# Altium project Opticni HRM.PrjPcb
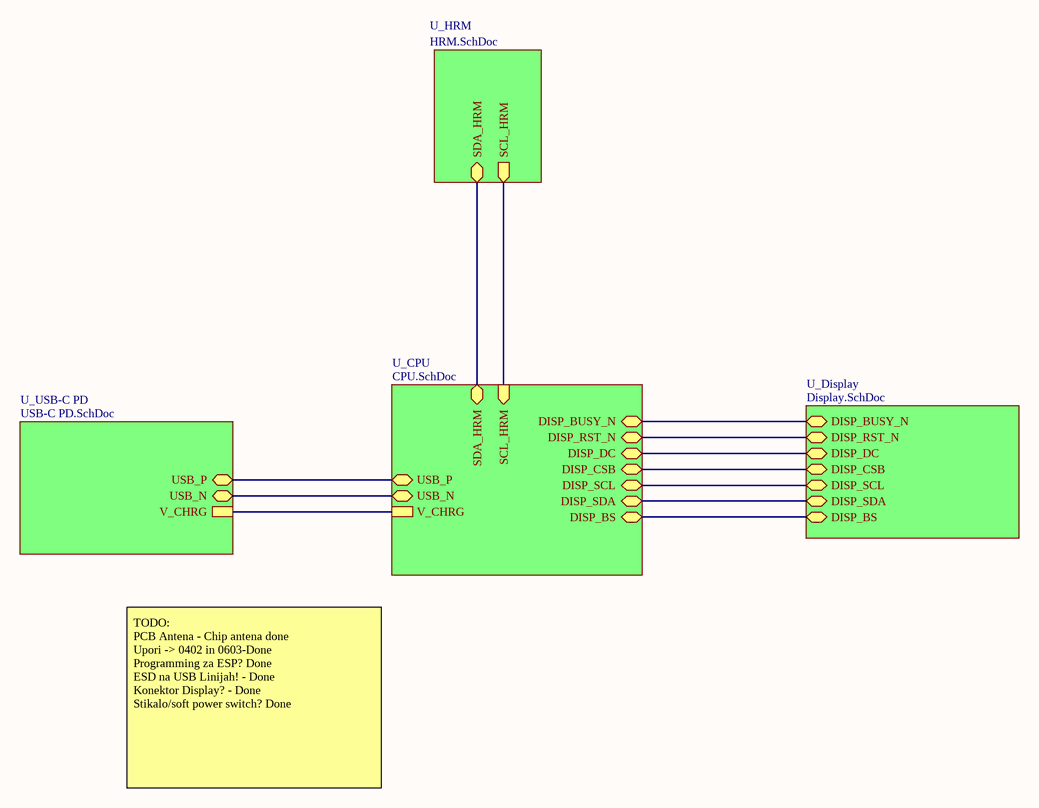
[diagram p0: Main.SchDoc]
5 sheets, 75 parts. Net scope: hierarchical (ports join the sheet entries above them; power ports are global).
Board file: HRM_0.1.PcbDoc
Sheets:
  Main.SchDoc
    U_HRM = HRM.SchDoc
    U_CPU = CPU.SchDoc
    U_Display = Display.SchDoc
    U_USB-C PD = USB-C PD.SchDoc

## Sheet Main.SchDoc
size A4

### Sub-sheets
U_CPU = CPU.SchDoc: SDA_HRM (bidir), SCL_HRM (in), DISP_BUSY_N (bidir), DISP_RST_N (bidir), DISP_DC (bidir), DISP_CSB (bidir), DISP_SCL (bidir), DISP_SDA (bidir), DISP_BS (bidir), USB_P (bidir), USB_N (bidir), V_CHRG
U_Display = Display.SchDoc: DISP_BUSY_N (bidir), DISP_RST_N (bidir), DISP_DC (bidir), DISP_CSB (bidir), DISP_SCL (bidir), DISP_SDA (bidir), DISP_BS (bidir)
U_HRM = HRM.SchDoc: SDA_HRM (bidir), SCL_HRM (out)
U_USB-C PD = USB-C PD.SchDoc: USB_P (bidir), USB_N (bidir), V_CHRG

### Nets
SCL_HRM: sheet U_HRM/SCL_HRM, sheet U_CPU/SCL_HRM
SDA_HRM: sheet U_HRM/SDA_HRM, sheet U_CPU/SDA_HRM
USB_N: sheet U_CPU/USB_N, sheet U_USB-C PD/USB_N
USB_P: sheet U_CPU/USB_P, sheet U_USB-C PD/USB_P
NetDS1_8: sheet U_CPU/DISP_BS, sheet U_Display/DISP_BS
NetDS1_9: sheet U_CPU/DISP_BUSY_N, sheet U_Display/DISP_BUSY_N
NetDS1_10: sheet U_CPU/DISP_RST_N, sheet U_Display/DISP_RST_N
NetDS1_11: sheet U_CPU/DISP_DC, sheet U_Display/DISP_DC
NetDS1_12: sheet U_CPU/DISP_CSB, sheet U_Display/DISP_CSB
NetDS1_13: sheet U_CPU/DISP_SCL, sheet U_Display/DISP_SCL
NetDS1_14: sheet U_CPU/DISP_SDA, sheet U_Display/DISP_SDA
NetR4_2: sheet U_CPU/V_CHRG, sheet U_USB-C PD/V_CHRG

### Notes on the sheet
- TODO:
  PCB Antena - Chip antena done
  Upori -> 0402 in 0603-Done
  Programming za ESP? Done
  ESD na USB Linijah! - Done
  Konektor Display? - Done
  Stikalo/soft power switch? Done

## Sheet HRM.SchDoc
size A4
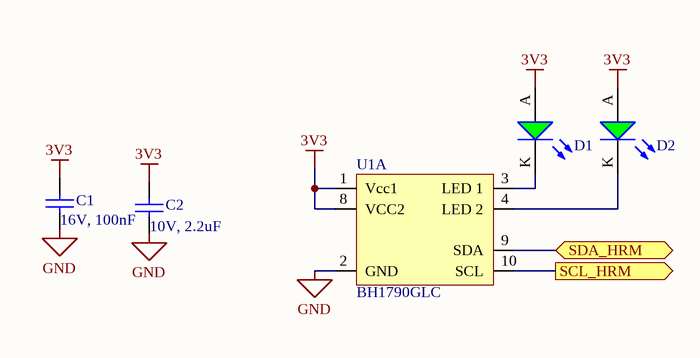
[diagram p1: HRM.SchDoc]

### Parts
C1  16V, 100nF  [0603_1.6x0.8x0.8mm_Reflow Soldering]
C2  10V, 2.2uF  [0603_1.6x0.8x0.8mm_Reflow Soldering]
D1  Bright Green, 2V, 140°  [WL-SMCW_0603_150060xx75003]  (value not drawn)
D2  Bright Green, 2V, 140°  [WL-SMCW_0603_150060xx75003]  (value not drawn)
U1  BH1790GLC  [WLGA010V28_ROHM]  (part A of 2)

### Ports
SCL_HRM (out), SDA_HRM (bidir)

### Nets
3V3: C1.2 C2.2 D1.A D2.A U1.1(Vcc1) U1.8(VCC2)
GND: C1.1 C2.1 U1.2(GND)
SCL_HRM: U1.10(SCL) ; port SCL_HRM
SDA_HRM: U1.9(SDA) ; port SDA_HRM
NetD1_K: D1.K U1.3(LED_1)
NetD2_K: D2.K U1.4(LED_2)

### Library data of the parts
C1 = 885012206046: WCAP-CSGP Ceramic Capacitors, 0603, X7R, 16V, 100nF; Rated Voltage: 16V DC; ComponentLink1Description: Manufacturer; ComponentLink1URL: http://www.we-online.de; ComponentLink2Description: Datasheet; ComponentLink2URL: http://katalog.we-online.de/pbs/datasheet/885012206046.pdf; Part Number: 885012206046; Published Date: Oct. 2017; Publisher: Wurth Elektronik; Size: 0603; Operating Temperature: -55 °C to +125 °C; Value: 100nF; Ceramic Type: X7R
C2 = 885012206027: WCAP-CSGP Ceramic Capacitors, 0603, X7R, 10V, 2.2uF; Rated Voltage: 10V DC; ComponentLink1Description: Manufacturer; ComponentLink1URL: http://www.we-online.de; ComponentLink2Description: Datasheet; ComponentLink2URL: http://katalog.we-online.de/pbs/datasheet/885012206027.pdf; Part Number: 885012206027; Published Date: Oct. 2017; Publisher: Wurth Elektronik; Size: 0603; Operating Temperature: -55 °C to +125 °C; Value: 2.2uF; Ceramic Type: X7R
D1 D2 = 150060VS75003: WL-SMCW Mono-color Chip LED Waterclear, SMT, size 0603, Bright Green, 2V, 140°; Manufacturer: Wurth Elektronik; Case/Size Code: 0603; Chip Technology: AlInGaP; Dominant Wavelength: 570nm; Luminous Intensity: 100mcd; Peak Wavelength: 572nm; Manufacturer Part Number: 150060VS75003; Category: Signal LEDs; Match Code: WL-SMCW; ComponentLink1Description: Website Link; ComponentLink1URL: https://www.we-online.com/redexpert/article/150060VS75003?ad; ComponentLink2Description: Datasheet Link; ComponentLink2URL: https://www.we-online.com/redexpert/spec/150060VS75003?ad; Mount: Surface Mount; Operating Temperature Max: 100°C; Operating Temperature Min: -40°C; Packaging: Tape and Reel; Length: 1.6mm; Width: 0.8mm; Height: 0.7mm; Emitting Color: Bright Green; Forward Voltage: 2V; Viewing Angle: 140°
U1 = BH1790GLC: Optical Sensor for Heart Rate Monitor IC

## Sheet CPU.SchDoc
size A4
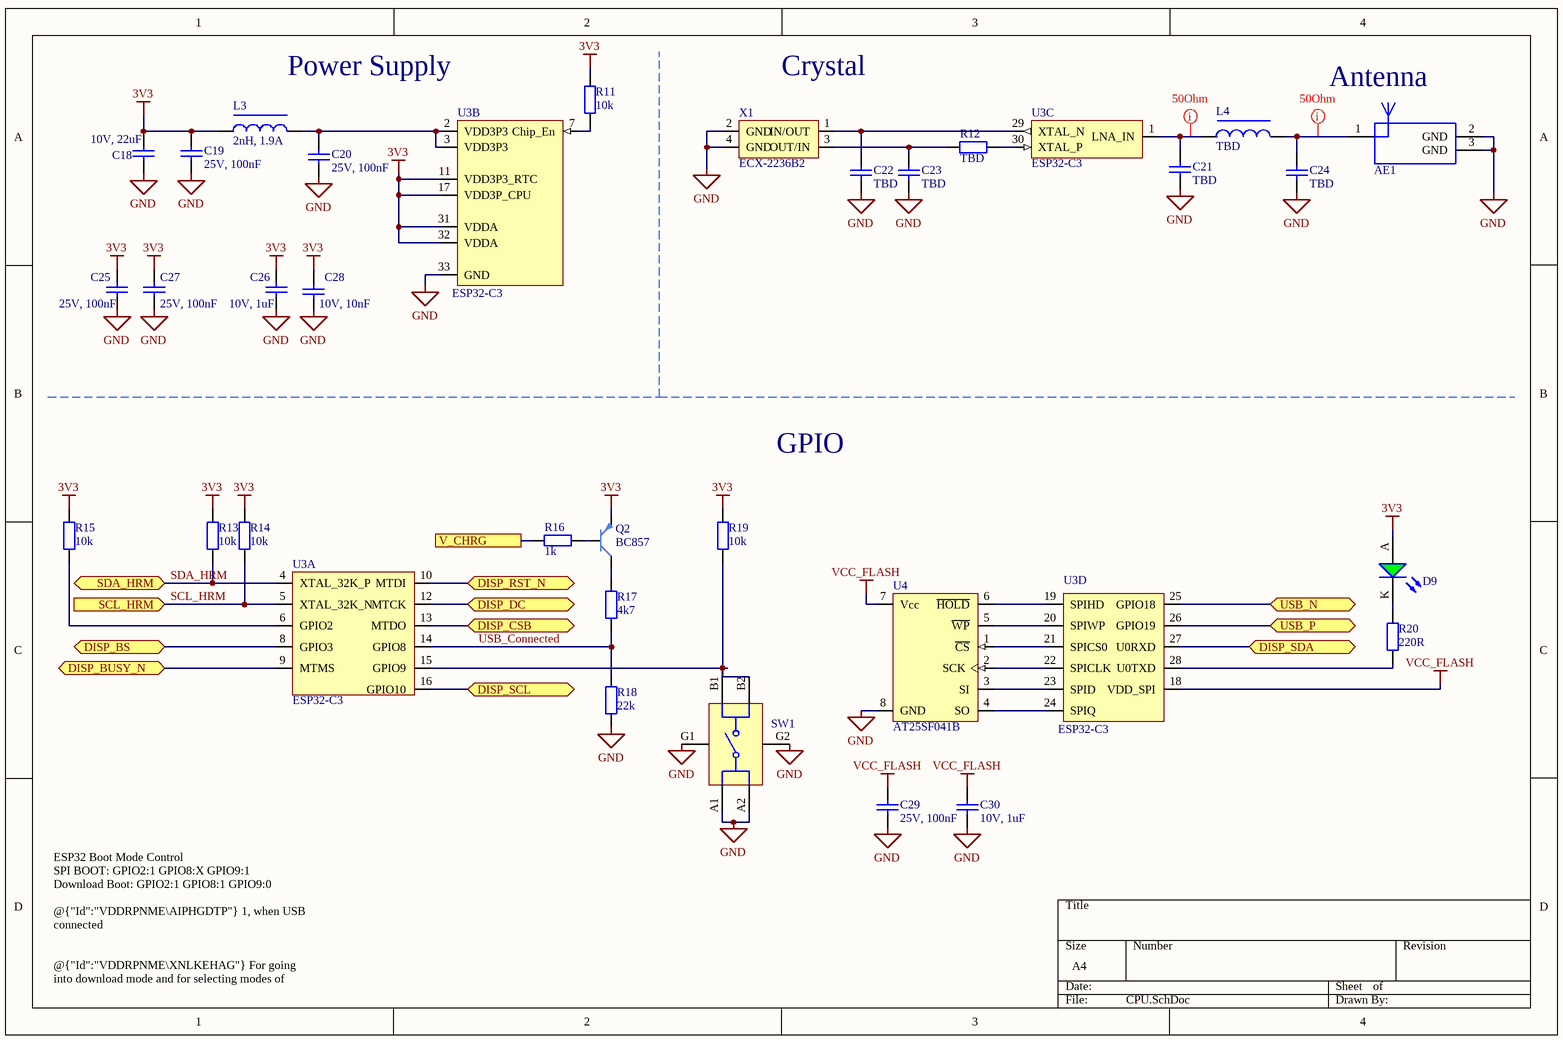
[diagram p2: CPU.SchDoc]

### Parts
AE1  7488960245  [7488960245]  (value not drawn)
C18  10V, 22uF  [0805_2x1.25x1.25mm_Reflow Soldering]
C19  25V, 100nF  [0402_1x0.5x0.5mm]
C20  25V, 100nF  [0402_1x0.5x0.5mm]
C21  TBD  [0402_1x0.5x0.5mm]
C22  TBD  [0402_1x0.5x0.5mm]
C23  TBD  [0402_1x0.5x0.5mm]
C24  TBD  [0402_1x0.5x0.5mm]
C25  25V, 100nF  [0402_1x0.5x0.5mm]
C26  10V, 1uF  [0402_1x0.5x0.5mm]
C27  25V, 100nF  [0402_1x0.5x0.5mm]
C28  10V, 10nF  [0402_1x0.5x0.5mm]
C29  25V, 100nF  [0402_1x0.5x0.5mm]
C30  10V, 1uF  [0402_1x0.5x0.5mm]
D9  Green, 3.2V, 140°  [WL-SMCW_0603_150060xx75003]  (value not drawn)
L3  2nH, 1.9A  [0603CT SERIES]
L4  TBD  [0402CS SERIES]
Q2  BC857  [SOT23]
R11  10k  [R0402]
R12  TBD  [R0402]
R13  10k  [R0402]
R14  10k  [R0402]
R15  10k  [R0402]
R16  1k  [R0402]
R17  4k7  [R0402]
R18  22k  [R0402]
R19  10k  [R0402]
R20  220R  [R0402]
SW1  435151014845  [WS-TASV_L3W2.6H1.4_4351x10148xx]  (value not drawn)
U3  ESP32-C3  [32L SLP Expressif]  (parts A,B,C,D of 4)
U4  AT25SF041B  [SOIC8 Wide dialog semi]
X1  ECX-2236B2  [2.5 x 2.0 mm XTAL]

### Ports
DISP_BS (bidir), DISP_BUSY_N (bidir), DISP_CSB (bidir), DISP_DC (bidir), DISP_RST_N (bidir), DISP_SCL (bidir), DISP_SDA (bidir), SCL_HRM (in), SDA_HRM (bidir), USB_N (bidir), USB_P (bidir), V_CHRG

### Nets
3V3: C18.1 C19.2 C25.2 C26.2 C27.2 C28.2 D9.A L3.1 Q2.2(E) R11.2 R13.2 R14.2 R15.2 R19.2 U3.11(VDD3P3_RTC) U3.17(VDD3P_CPU) U3.31(VDDA) U3.32(VDDA)
GND: AE1.2(GND) AE1.3(GND) C18.2 C19.1 C20.1 C21.1 C22.1 C23.1 C24.1 C25.1 C26.1 C27.1 C28.1 C29.1 C30.1 R18.1 SW1.A1 SW1.A2 SW1.G1(GND) SW1.G2(GND) U3.33(GND) U4.8(GND) X1.2(GND) X1.4(GND)
VCC_FLASH: C29.2 C30.2 U3.18(VDD_SPI) U4.7(Vcc)
SCL_HRM: R14.1 U3.5(XTAL_32K_N) ; port SCL_HRM
SDA_HRM: R13.1 U3.4(XTAL_32K_P) ; port SDA_HRM
USB_Connected: R17.1 R18.2 U3.14(GPIO8)
USB_N: U3.25(GPIO18) ; port USB_N
USB_P: U3.26(GPIO19) ; port USB_P
NetAE1_1: AE1.1(Feed) C24.2 L4.2
NetC20_2: C20.2 L3.2 U3.2(VDD3P3) U3.3(VDD3P3)
NetC21_2: C21.2 L4.1 U3.1(LNA_IN)
NetC22_2: C22.2 U3.29(XTAL_N) X1.1(IN/OUT)
NetC23_2: C23.2 R12.2 X1.3(OUT/IN)
NetD9_K: D9.K R20.2
NetDS1_8: U3.8(GPIO3) ; port DISP_BS
NetDS1_9: U3.9(MTMS) ; port DISP_BUSY_N
NetDS1_10: U3.10(MTDI) ; port DISP_RST_N
NetDS1_11: U3.12(MTCK) ; port DISP_DC
NetDS1_12: U3.13(MTDO) ; port DISP_CSB
NetDS1_13: U3.16(GPIO10) ; port DISP_SCL
NetDS1_14: U3.27(U0RXD) ; port DISP_SDA
NetQ2_1: Q2.1(B) R16.1
NetQ2_3: Q2.3(C) R17.2
NetR4_2: R16.2 ; port V_CHRG
NetR11_1: R11.1 U3.7(Chip_En)
NetR12_1: R12.1 U3.30(XTAL_P)
NetR15_1: R15.1 U3.6(GPIO2)
NetR19_1: R19.1 SW1.B2
NetR20_1: R20.1 U3.28(U0TXD)
NetSW1_B1: SW1.B1 U3.15(GPIO9)
NetU3_19: U3.19(SPIHD) U4.6(~{HOLD})
NetU3_20: U3.20(SPIWP) U4.5(~{WP})
NetU3_21: U3.21(SPICS0) U4.1(~{CS})
NetU3_22: U3.22(SPICLK) U4.2(SCK)
NetU3_23: U3.23(SPID) U4.3(SI)
NetU3_24: U3.24(SPIQ) U4.4(SO)

### Layout directives
mark named 50Ohm: NetAE1_1, NetC21_2

### Notes on the sheet
- Power Supply
- (near X1) Crystal
- (near AE1) Antenna
- GPIO
- ESP32 Boot Mode Control
  SPI BOOT: GPIO2:1 GPIO8:X GPIO9:1
  Download Boot: GPIO2:1 GPIO8:1 GPIO9:0
  @{"Id":"VDDRPNME\AIPHGDTP"} 1, when USB connected
  @{"Id":"VDDRPNME\XNLKEHAG"} For going into download mode and for selecting modes of operation

### Library data of the parts
AE1 = 7488960245: WE-MCA SMT Multilayer Chip Antenna, 1 Band, 2400-2500MHz, 50Ω; Manufacturer: Wurth Elektronik; Number of Bands: 1; Peak Gain: 3dBi; VSWR: 2.5; ComponentLink1Description: Website Link; ComponentLink1URL: https://www.we-online.com/redexpert/article/7488960245?ad; ComponentLink2Description: Datasheet Link; ComponentLink2URL: https://www.we-online.com/redexpert/spec/7488960245?ad; Manufacturer Part Number: 7488960245; Category: Antennas; Match Code: WE-MCA; Mount: Surface Mount; Operating Temperature Max: 85°C; Operating Temperature Min: -40°C; Packaging: Tape and Reel; Length: 5.2mm; Width: 3.7mm; Height: 0.7mm; Frequency Range: 2400-2500MHz; Impedance: 50Ω
C18 = 885012107011: WCAP-CSGP Ceramic Capacitors, 0805, X5R, 10V, 22uF; Rated Voltage: 10V DC; ComponentLink1Description: Manufacturer; ComponentLink1URL: http://www.we-online.de; ComponentLink2Description: Datasheet; ComponentLink2URL: http://katalog.we-online.de/pbs/datasheet/885012107011.pdf; Part Number: 885012107011; Published Date: Oct. 2017; Publisher: Wurth Elektronik; Size: 0805; Operating Temperature: -55 °C to +125 °C; Value: 22uF; Ceramic Type: X5R
C19 C20 C25 C27 C29 = 885012105018: WCAP-CSGP Ceramic Capacitors, 0402, X5R, 25V, 100nF; Rated Voltage: 25V DC; ComponentLink1Description: Manufacturer; ComponentLink1URL: http://www.we-online.de; ComponentLink2Description: Datasheet; ComponentLink2URL: http://katalog.we-online.de/pbs/datasheet/885012105018.pdf; Part Number: 885012105018; Published Date: Oct. 2017; Publisher: Wurth Elektronik; Size: 0402; Operating Temperature: -55 °C to +125 °C; Value: 100nF; Ceramic Type: X5R
C21-C24 = 885012005021: WCAP-CSGP Ceramic Capacitors, 0402, NP0, 16V, 2.2pF; Rated Voltage: 16V DC; ComponentLink1Description: Manufacturer; ComponentLink1URL: http://www.we-online.de; ComponentLink2Description: Datasheet; ComponentLink2URL: http://katalog.we-online.de/pbs/datasheet/885012005021.pdf; Part Number: 885012005021; Published Date: Oct. 2017; Publisher: Wurth Elektronik; Size: 0402; Operating Temperature: -55 °C to +125 °C; Value: 2.2pF; Ceramic Type: NP0
C26 C30 = 885012105012: WCAP-CSGP Ceramic Capacitors, 0402, X5R, 10V, 1uF; Rated Voltage: 10V DC; ComponentLink1Description: Manufacturer; ComponentLink1URL: http://www.we-online.de; ComponentLink2Description: Datasheet; ComponentLink2URL: http://katalog.we-online.de/pbs/datasheet/885012105012.pdf; Part Number: 885012105012; Published Date: Oct. 2017; Publisher: Wurth Elektronik; Size: 0402; Operating Temperature: -55 °C to +125 °C; Value: 1uF; Ceramic Type: X5R
C28 = 885012205012: WCAP-CSGP Ceramic Capacitors, 0402, X7R, 10V, 10nF; Rated Voltage: 10V DC; ComponentLink1Description: Manufacturer; ComponentLink1URL: http://www.we-online.de; ComponentLink2Description: Datasheet; ComponentLink2URL: http://katalog.we-online.de/pbs/datasheet/885012205012.pdf; Part Number: 885012205012; Published Date: Oct. 2017; Publisher: Wurth Elektronik; Size: 0402; Operating Temperature: -55 °C to +125 °C; Value: 10nF; Ceramic Type: X7R
D9 = 150060GS75003: WL-SMCW Mono-color Chip LED Waterclear, SMT, size 0603, Green, 3.2V, 140°; Manufacturer: Wurth Elektronik; Case/Size Code: 0603; Chip Technology: InGaN; Dominant Wavelength: 525nm; Luminous Intensity: 1600mcd; Peak Wavelength: 515nm; Manufacturer Part Number: 150060GS75003; Category: Signal LEDs; Match Code: WL-SMCW; ComponentLink1Description: Website Link; ComponentLink1URL: https://www.we-online.com/redexpert/article/150060GS75003?ad; ComponentLink2Description: Datasheet Link; ComponentLink2URL: https://www.we-online.com/redexpert/spec/150060GS75003?ad; Mount: Surface Mount; Operating Temperature Max: 100°C; Operating Temperature Min: -40°C; Packaging: Tape and Reel; Length: 1.6mm; Width: 0.8mm; Height: 0.7mm; Emitting Color: Green; Forward Voltage: 3.2V; Viewing Angle: 140°
L3 = 0603CT-2N0XJRW
L4 = 0402CT: 0402 Coil - Coilcraft
R11-R20 = Res 0402
SW1 = 435151014845: WS-TASV SMT Tact Switch with ground terminal, SPST-NO, 12VDC, 50mA, 450g; Manufacturer: Wurth Elektronik; Washable: No; ComponentLink1Description: Website Link; ComponentLink1URL: https://www.we-online.com/redexpert/article/435151014845?ad; ComponentLink2Description: Datasheet Link; ComponentLink2URL: https://www.we-online.com/redexpert/spec/435151014845?ad; Manufacturer Part Number: 435151014845; Category: Tact Switches; Match Code: WS-TASV; Mount: Surface Mount; Operating Temperature Max: 85°C; Operating Temperature Min: -40°C; Packaging: Tape and Reel; Length: 3mm; Width: 2.6mm; Height: 1.4mm; Circuit: SPST-NO; Contact Material: Stainless Steel; Contact Plating: Silver; Operation Force: 450g; Rated Current: 50mA; Rated Voltage: 12VDC; Terminal Material: Copper Alloy; Terminal Plating: Silver
U3 = ESP32-C3: Ultra­Low­Power SoC with RISC­V Single­Core CPU / Supporting IEEE 802.11b/g/n (2.4 GHz Wi­Fi) and Bluetooth® 5 (LE)
U4 = AT25SF041B: 4-Mbit SPI Serial Flash Memory with Dual-I/O and Quad-I/O Support
X1 = ECX-2236B2: ECX-2236B2 SMD CRYSTAL 40MHz +-10ppm

## Sheet Display.SchDoc
size A4
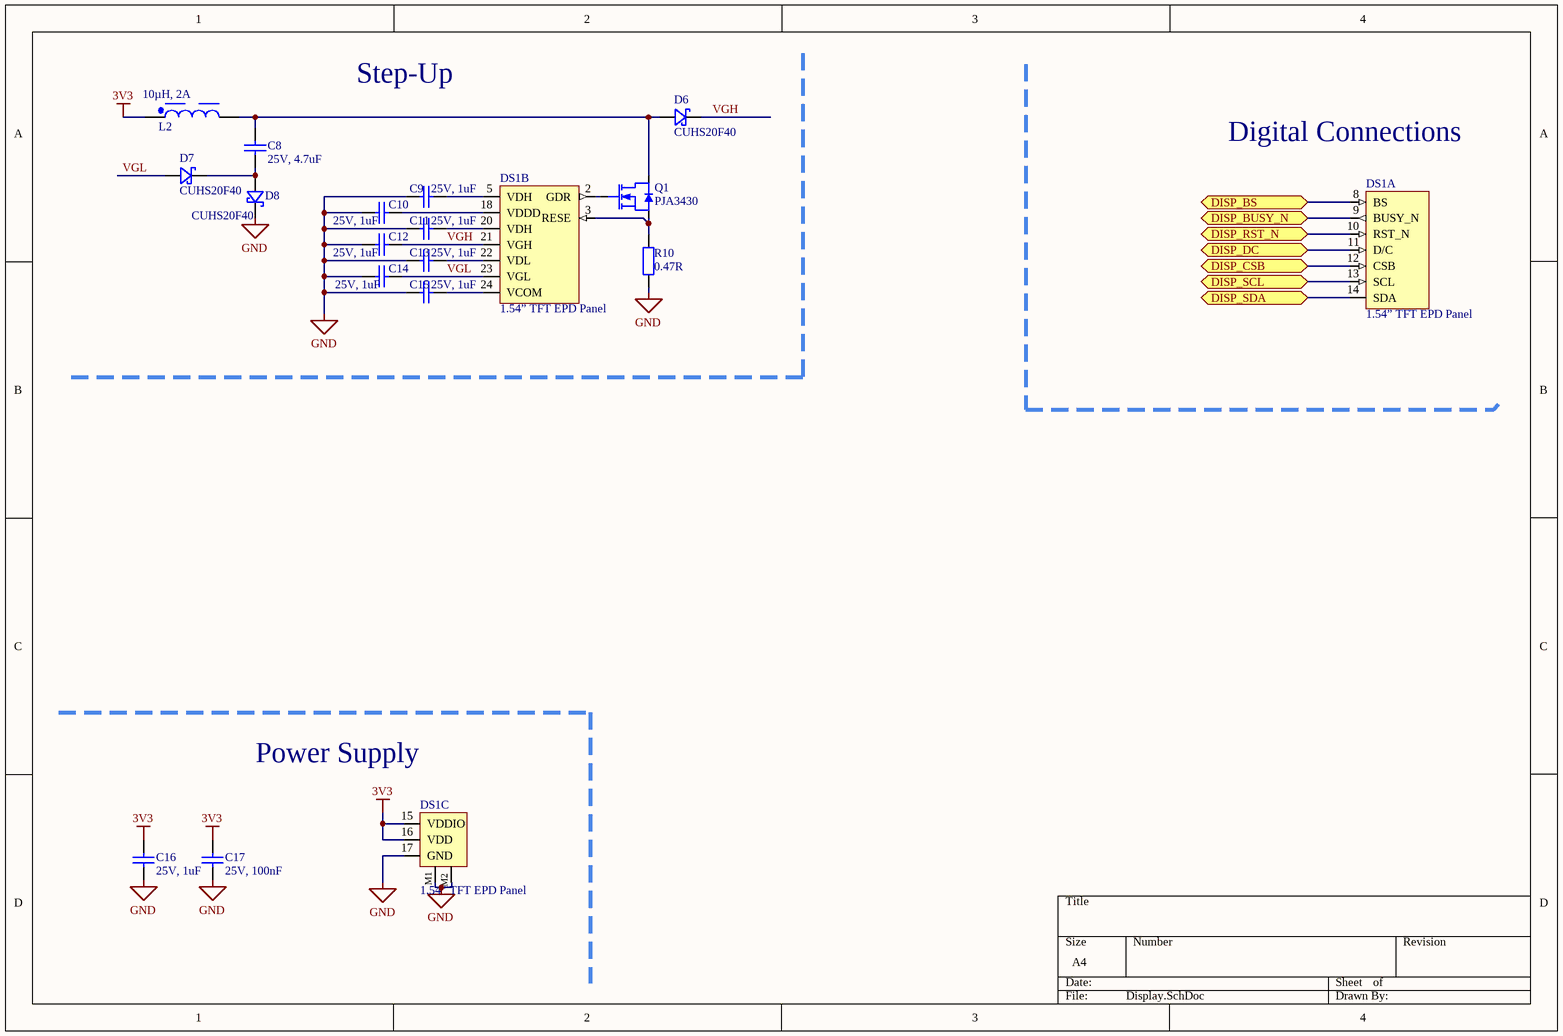
[diagram p3: Display.SchDoc]

### Parts
C8  25V, 4.7uF  [0805_2x1.25x1.25mm_Reflow Soldering]
C9  25V, 1uF  [0603_1.6x0.8x0.8mm_Reflow Soldering]
C10  25V, 1uF  [0603_1.6x0.8x0.8mm_Reflow Soldering]
C11  25V, 1uF  [0603_1.6x0.8x0.8mm_Reflow Soldering]
C12  25V, 1uF  [0603_1.6x0.8x0.8mm_Reflow Soldering]
C13  25V, 1uF  [0603_1.6x0.8x0.8mm_Reflow Soldering]
C14  25V, 1uF  [0603_1.6x0.8x0.8mm_Reflow Soldering]
C15  25V, 1uF  [0603_1.6x0.8x0.8mm_Reflow Soldering]
C16  25V, 1uF  [0603_1.6x0.8x0.8mm_Reflow Soldering]
C17  25V, 100nF  [0402_1x0.5x0.5mm]
D6  CUHS20F40  [Topshiba US2H]
D7  CUHS20F40  [Topshiba US2H]
D8  CUHS20F40  [Topshiba US2H]
DS1  1.54” TFT EPD Panel  [687324124422]  (parts A,B,C of 4)
L2  10µH, 2A  [WE-TPC_8020]
Q1  PJA3430  [SOT23]
R10  value 0.47R  [RES0805_1]  (hidden comment: Res2-smd)

### Ports
DISP_BS (bidir), DISP_BUSY_N (bidir), DISP_CSB (bidir), DISP_DC (bidir), DISP_RST_N (bidir), DISP_SCL (bidir), DISP_SDA (bidir)

### Nets
3V3: C16.2 C17.2 DS1.15(VDDIO) DS1.16(VDD) L2.1
GND: C9.1 C10.1 C11.1 C12.1 C13.1 C14.1 C15.1 C16.1 C17.1 D8.1(K) DS1.17(GND) DS1.M1 DS1.M2 R10.1
VGH: C12.2 D6.1(K) DS1.21(VGH)
VGL: C14.2 D7.2(A) DS1.23(VGL)
NetC8_1: C8.1 D7.1(K) D8.2(A)
NetC8_2: C8.2 D6.2(A) L2.2 Q1.3(D)
NetC9_2: C9.2 DS1.5(VDH)
NetC10_2: C10.2 DS1.18(VDDD)
NetC11_2: C11.2 DS1.20(VDH)
NetC13_2: C13.2 DS1.22(VDL)
NetC15_2: C15.2 DS1.24(VCOM)
NetDS1_2: DS1.2(GDR) Q1.1(G)
NetDS1_3: DS1.3(RESE) Q1.2(S) R10.2
NetDS1_8: DS1.8(BS) ; port DISP_BS
NetDS1_9: DS1.9(BUSY_N) ; port DISP_BUSY_N
NetDS1_10: DS1.10(RST_N) ; port DISP_RST_N
NetDS1_11: DS1.11(D/C) ; port DISP_DC
NetDS1_12: DS1.12(CSB) ; port DISP_CSB
NetDS1_13: DS1.13(SCL) ; port DISP_SCL
NetDS1_14: DS1.14(SDA) ; port DISP_SDA

### Notes on the sheet
- Step-Up
- (near DS1) Digital Connections
- (near DS1) Power Supply

### Library data of the parts
C8 = 885012107018: WCAP-CSGP Ceramic Capacitors, 0805, X5R, 25V, 4.7uF; Rated Voltage: 25V DC; ComponentLink1Description: Manufacturer; ComponentLink1URL: http://www.we-online.de; ComponentLink2Description: Datasheet; ComponentLink2URL: http://katalog.we-online.de/pbs/datasheet/885012107018.pdf; Part Number: 885012107018; Published Date: Oct. 2017; Publisher: Wurth Elektronik; Size: 0805; Operating Temperature: -55 °C to +125 °C; Value: 4.7uF; Ceramic Type: X5R
C9-C16 = 885012106022: WCAP-CSGP Ceramic Capacitors, 0603, X5R, 25V, 1uF; Rated Voltage: 25V DC; ComponentLink1Description: Manufacturer; ComponentLink1URL: http://www.we-online.de; ComponentLink2Description: Datasheet; ComponentLink2URL: http://katalog.we-online.de/pbs/datasheet/885012106022.pdf; Part Number: 885012106022; Published Date: Oct. 2017; Publisher: Wurth Elektronik; Size: 0603; Operating Temperature: -55 °C to +125 °C; Value: 1uF; Ceramic Type: X5R
C17 = 885012105018: as C19 on sheet CPU; ComponentLink1Description: Manufacturer; ComponentLink1URL: http://www.we-online.de; ComponentLink2Description: Datasheet; ComponentLink2URL: http://katalog.we-online.de/pbs/datasheet/885012105018.pdf; Part Number: 885012105018; Published Date: Oct. 2017; Publisher: Wurth Elektronik; Size: 0402; Operating Temperature: -55 °C to +125 °C; Value: 100nF; Ceramic Type: X5R
D6-D8 = CUHS20F40: Schottky Barrier Diode Silicon Epitaxia
DS1 = E2154CS0C1: Wurth 687124183622 connector for horizontal, / Wurth 687324124422 for vertical
L2 = 7440700100: WE-TPC SMT Tiny Power Inductor, 8020, 10µH, 2A, 94mΩ; Manufacturer: Wurth Elektronik; Case/Size Code: 8020; DC Resistance: 78mΩ; Saturation Current: 1.55A; Self Resonant Frequency: 30MHz; ComponentLink1Description: Website Link; ComponentLink1URL: https://www.we-online.com/redexpert/article/7440700100?ad; ComponentLink2Description: Datasheet Link; ComponentLink2URL: https://www.we-online.com/redexpert/spec/7440700100?ad; Manufacturer Part Number: 7440700100; Category: Shielded Power Inductors; Match Code: WE-TPC; Mount: Surface Mount; Operating Temperature Max: 125°C; Operating Temperature Min: -40°C; Packaging: Tape and Reel; Length: 8mm; Width: 8mm; Height: 1.8mm; DC Resistance Max: 94mΩ; Inductance: 10µH; Rated Current: 2A
Q1 = PJA3430_R1_00001: 20V/2A N-Channel Enhancment Mode MOSFET

## Sheet USB-C PD.SchDoc
size A4
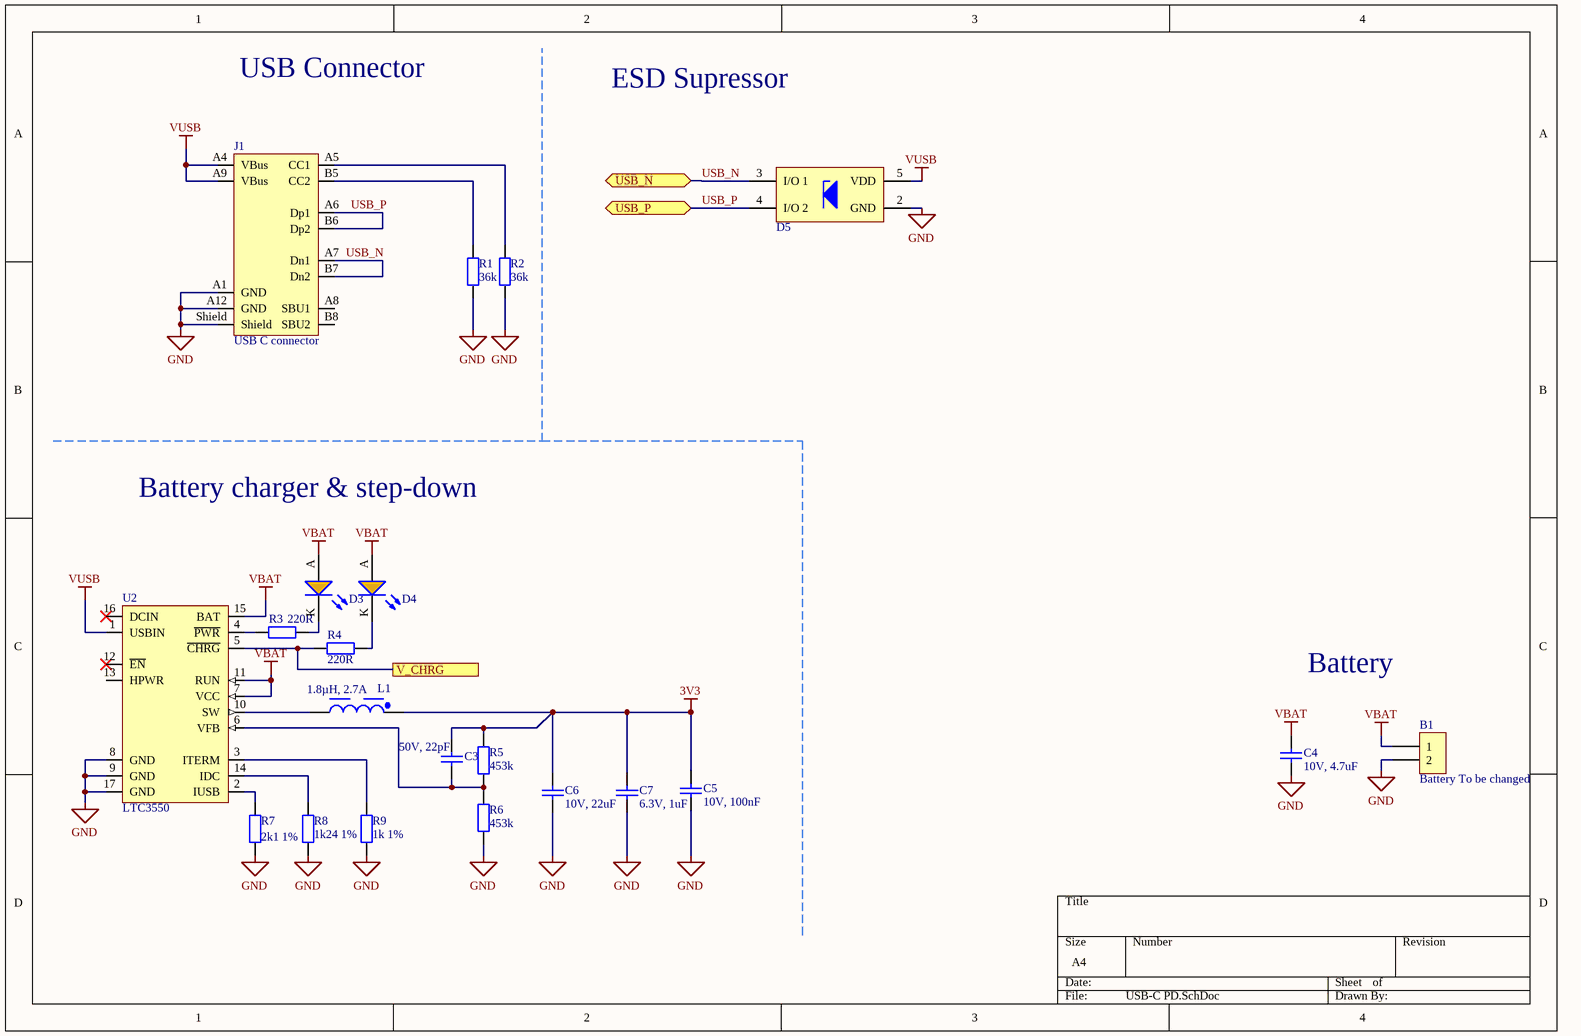
[diagram p4: USB-C PD.SchDoc]

### Parts
B1  Battery To be changed  [letev2]
C3  50V, 22pF  [0402_1x0.5x0.5mm]
C4  10V, 4.7uF  [0603_1.6x0.8x0.8mm_Reflow Soldering]
C5  10V, 100nF  [0603_1.6x0.8x0.8mm_Reflow Soldering]
C6  10V, 22uF  [0805_2x1.25x1.25mm_Reflow Soldering]
C7  6.3V, 1uF  [0603_1.6x0.8x0.8mm_Reflow Soldering]
D3  Amber, 2V, 140°  [WL-SMCW_0603_150060xx75000]  (value not drawn)
D4  Amber, 2V, 140°  [WL-SMCW_0603_150060xx75000]  (value not drawn)
D5  5V  [WE-TVS_SOT23-5L]  (value not drawn)
J1  USB C connector  [USB4105-15-A-120]
L1  1.8µH, 2.7A  [WE-TPC_4828]
R1  value 36k  [R0402]  (hidden comment: Res2-smd)
R2  value 36k  [R0402]  (hidden comment: Res2-smd)
R3  220R  [R0402]
R4  220R  [R0402]
R5  value 453k  [R0402]  (hidden comment: Res2-smd)
R6  value 453k  [R0402]  (hidden comment: Res2-smd)
R7  value 2k1 1%  [R0402]  (hidden comment: Res2-smd)
R8  value 1k24 1%  [R0402]  (hidden comment: Res2-smd)
R9  value 1k 1%  [R0402]  (hidden comment: Res2-smd)
U2  LTC3550  [DHC16 Linear]

### Ports
USB_N (bidir), USB_P (bidir), V_CHRG

### Nets
3V3: C3.2 C5.2 C6.2 C7.2 L1.1 R5.2
GND: B1.2 C4.1 C5.1 C6.1 C7.1 D5.2(GND) J1.A1(GND) J1.A12(GND) J1.Shield R1.1 R2.1 R6.1 R7.1 R8.1 R9.1 U2.8(GND) U2.9(GND) U2.17(GND)
VBAT: B1.1 C4.2 D3.A D4.A U2.7(VCC) U2.11(RUN) U2.15(BAT)
VUSB: D5.5(VDD) J1.A4(VBus) J1.A9(VBus) U2.1(USBIN)
USB_N: D5.3(I/O_1) J1.A7(Dn1) J1.B7(Dn2) ; port USB_N
USB_P: D5.4(I/O_2) J1.A6(Dp1) J1.B6(Dp2) ; port USB_P
NetC3_1: C3.1 R5.1 R6.2 U2.6(VFB)
NetD3_K: D3.K R3.1
NetD4_K: D4.K R4.1
NetJ1_A5: J1.A5(CC1) R2.2
NetJ1_B5: J1.B5(CC2) R1.2
NetL1_2: L1.2 U2.10(SW)
NetR3_2: R3.2 U2.4(~{PWR})
NetR4_2: R4.2 U2.5(~{CHRG}) ; port V_CHRG
NetR7_2: R7.2 U2.2(IUSB)
NetR8_2: R8.2 U2.14(IDC)
NetR9_2: R9.2 U2.3(ITERM)

Not connected (* = marked no-connect by the designer): J1 A8(SBU1) B8(SBU2); U2 12(~{EN})* 13(HPWR) 16(DCIN)*

### Notes on the sheet
- USB Connector
- ESD Supressor
- Battery charger & step-down
- Battery

### Library data of the parts
B1 = header2
C3 = 885012005057: WCAP-CSGP Ceramic Capacitors, 0402, NP0, 50V, 22pF; Rated Voltage: 50V DC; ComponentLink1Description: Manufacturer; ComponentLink1URL: http://www.we-online.de; ComponentLink2Description: Datasheet; ComponentLink2URL: http://katalog.we-online.de/pbs/datasheet/885012005057.pdf; Part Number: 885012005057; Published Date: Oct. 2017; Publisher: Wurth Elektronik; Size: 0402; Operating Temperature: -55 °C to +125 °C; Value: 22pF; Ceramic Type: NP0
C4 = 885012106012: WCAP-CSGP Ceramic Capacitors, 0603, X5R, 10V, 4.7uF; Rated Voltage: 10V DC; ComponentLink1Description: Manufacturer; ComponentLink1URL: http://www.we-online.de; ComponentLink2Description: Datasheet; ComponentLink2URL: http://katalog.we-online.de/pbs/datasheet/885012106012.pdf; Part Number: 885012106012; Published Date: Oct. 2017; Publisher: Wurth Elektronik; Size: 0603; Operating Temperature: -55 °C to +125 °C; Value: 4.7uF; Ceramic Type: X5R
C5 = 885012206020: WCAP-CSGP Ceramic Capacitors, 0603, X7R, 10V, 100nF; Rated Voltage: 10V DC; ComponentLink1Description: Manufacturer; ComponentLink1URL: http://www.we-online.de; ComponentLink2Description: Datasheet; ComponentLink2URL: http://katalog.we-online.de/pbs/datasheet/885012206020.pdf; Part Number: 885012206020; Published Date: Oct. 2017; Publisher: Wurth Elektronik; Size: 0603; Operating Temperature: -55 °C to +125 °C; Value: 100nF; Ceramic Type: X7R
C6 = 885012107011: as C18 on sheet CPU; ComponentLink1Description: Manufacturer; ComponentLink1URL: http://www.we-online.de; ComponentLink2Description: Datasheet; ComponentLink2URL: http://katalog.we-online.de/pbs/datasheet/885012107011.pdf; Part Number: 885012107011; Published Date: Oct. 2017; Publisher: Wurth Elektronik; Size: 0805; Operating Temperature: -55 °C to +125 °C; Value: 22uF; Ceramic Type: X5R
C7 = 885012106003: WCAP-CSGP Ceramic Capacitors, 0603, X5R, 6.3V, 1uF; Rated Voltage: 6.3V DC; ComponentLink1Description: Manufacturer; ComponentLink1URL: http://www.we-online.de; ComponentLink2Description: Datasheet; ComponentLink2URL: http://katalog.we-online.de/pbs/datasheet/885012106003.pdf; Part Number: 885012106003; Published Date: Oct. 2017; Publisher: Wurth Elektronik; Size: 0603; Operating Temperature: -55 °C to +125 °C; Value: 1uF; Ceramic Type: X5R
D3 D4 = 150060AS75000: WL-SMCW Mono-color Chip LED Waterclear, SMT, size 0603, Amber, 2V, 140°; Manufacturer: Wurth Elektronik; Case/Size Code: 0603; Chip Technology: AlInGaP; Dominant Wavelength: 605nm; Luminous Intensity: 130mcd; Peak Wavelength: 610nm; Manufacturer Part Number: 150060AS75000; Category: Signal LEDs; Match Code: WL-SMCW; ComponentLink1Description: Website Link; ComponentLink1URL: https://www.we-online.com/redexpert/article/150060AS75000?ad; ComponentLink2Description: Datasheet Link; ComponentLink2URL: https://www.we-online.com/redexpert/spec/150060AS75000?ad; Mount: Surface Mount; Operating Temperature Max: 85°C; Operating Temperature Min: -40°C; Packaging: Tape and Reel; Length: 1.6mm; Width: 0.8mm; Height: 0.7mm; Emitting Color: Amber; Forward Voltage: 2V; Viewing Angle: 140°
D5 = 824011: WE-TVS TVS Diode – High Speed Series, SOT23-5L, 2+1 Channel, 5V, 2pF; Manufacturer: Wurth Elektronik; Channel ESD Clamping Voltage: 13V; Channel Reverse Leakage Current: 1µA; ESD Air Discharge Capability: 24kV; ESD Contact Discharge Capability: 16kV; Polarity: Unidirectional; (Reverse) Breakdown Voltage: 6.1V; (Reverse) Peak Pulse Current: 13A; ComponentLink1Description: Website Link; ComponentLink1URL: https://www.we-online.com/redexpert/article/824011?ad; ComponentLink2Description: Datasheet Link; ComponentLink2URL: https://www.we-online.com/redexpert/spec/824011?ad; Manufacturer Part Number: 824011; Category: ESD Protection; Match Code: WE-TVS; Mount: Surface Mount; Operating Temperature Max: 125°C; Operating Temperature Min: -55°C; Packaging: Tape and Reel; Case/Size Code: SOT23-5L; Length: 2.9mm; Width: 2.8mm; Height: 1.16mm; Channel Input Capacitance: 2pF; Channel Operating Voltage: 5V; Number of Channels: 2+1
J1 = USB4105-15-A-120
L1 = 7440430018: WE-TPC SMT Tiny Power Inductor, 4828, 1.8µH, 2.7A, 25mΩ; Manufacturer: Wurth Elektronik; Case/Size Code: 4828; DC Resistance: 20mΩ; Saturation Current: 2.45A; Self Resonant Frequency: 120MHz; ComponentLink1Description: Website Link; ComponentLink1URL: https://www.we-online.com/redexpert/article/7440430018?ad; ComponentLink2Description: Datasheet Link; ComponentLink2URL: https://www.we-online.com/redexpert/spec/7440430018?ad; Manufacturer Part Number: 7440430018; Category: Shielded Power Inductors; Match Code: WE-TPC; Mount: Surface Mount; Operating Temperature Max: 125°C; Operating Temperature Min: -40°C; Packaging: Tape and Reel; Length: 4.8mm; Width: 4.8mm; Height: 2.8mm; DC Resistance Max: 25mΩ; Inductance: 1.8µH; Rated Current: 2.7A
R3 R4 = Res 0402
U2 = LTC3550: Dual Input USB/AC Adapter / Li-Ion Battery Charger with / 600mA Buck Converter

## Nets that join several sheets
3V3: HRM (6 pins), CPU (18 pins), Display (5 pins), USB-C PD (6 pins)
GND: HRM (C1.1 C2.1 U1.2), CPU (24 pins), Display (14 pins), USB-C PD (18 pins)
NetDS1_8: CPU (U3.8), Display (DS1.8)
NetDS1_9: CPU (U3.9), Display (DS1.9)
NetDS1_10: CPU (U3.10), Display (DS1.10)
NetDS1_11: CPU (U3.12), Display (DS1.11)
NetDS1_12: CPU (U3.13), Display (DS1.12)
NetDS1_13: CPU (U3.16), Display (DS1.13)
NetDS1_14: CPU (U3.27), Display (DS1.14)
NetR4_2: CPU (R16.2), USB-C PD (R4.2 U2.5)
SCL_HRM: HRM (U1.10), CPU (R14.1 U3.5)
SDA_HRM: HRM (U1.9), CPU (R13.1 U3.4)
USB_N: CPU (U3.25), USB-C PD (D5.3 J1.A7 J1.B7)
USB_P: CPU (U3.26), USB-C PD (D5.4 J1.A6 J1.B6)